# EAGLE design rx (EAGLE 9.1.3)
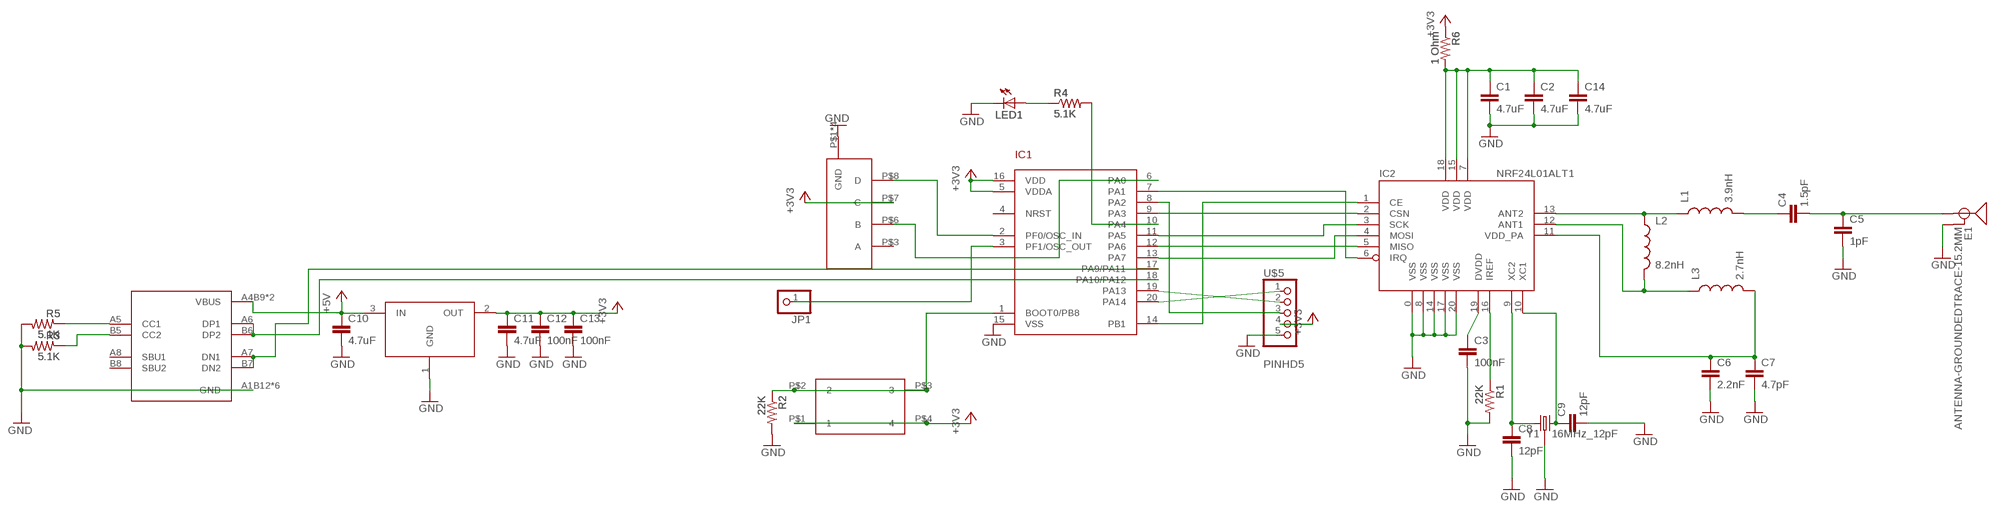
[diagram p0: schematic, sheet 1]

## Parts
C1  4.7uF  CAP0805  [0805]
C2  4.7uF  CAP0805  [0805]
C3  100nF  CAP0805  [0805]
C4  1.5pF  CAP0805  [0805]
C5  1pF  CAP0805  [0805]
C6  2.2nF  CAP0805  [0805]
C7  4.7pF  CAP0805  [0805]
C8  12pF  CAP0805  [0805]
C9  12pF  CAP0805  [0805]
C10  4.7uF  CAP0805  [0805]
C11  4.7uF  CAP0805  [0805]
C12  100nF  CAP0805  [0805]
C13  100nF  CAP0805  [0805]
C14  4.7uF  CAP0805  [0805]
E1  ANTENNA-GROUNDEDTRACE-15.2MM  [TRACE_ANTENNA_2.4GHZ_15.2MM]
IC1  STM32F042F4  [TSSOP20]
IC2  NRF24L01ALT1  [QFN20_ALT1]
JP1  PINHD-1X1CB  [1X01-CLEANBIG]
L1  3.9nH  INDUCTOR0805  [0805]
L2  8.2nH  INDUCTOR0805  [0805]
L3  2.7nH  INDUCTOR0805  [0805]
LED1  LEDCHIP-LED0805  [CHIP-LED0805]
R1  22K  RESISTOR0805-RES  [0805]
R2  22K  RESISTOR0805-RES  [0805]
R3  5.1K  RESISTOR0805-RES  [0805]
R4  5.1K  RESISTOR0805-RES  [0805]
R5  5.1K  RESISTOR0805-RES  [0805]
R6  1 Ohm  RESISTOR0805-RES  [0805]
SW1  SW_3POS_DEVSW_3POS_OFFICIAL  [SW_3POS_FOOT_OFFICIAL]
SW2  324_SW324_SWITCH_FOOT_HOLE  [342_SWICH_FOOT_HOLE]
U1  USBC_16P  [USBC_16P_FOOT]
U2  XC6206_DEV  [SOT23R_INFINEON]
U$5  PINHD5  [1X05]
Y1  16MHz_12pF  CRYSTAL-26MHZSMD-3.2X2.5  [CRYSTAL-SMD-3.2X2.5MM]

## Nets
+3V3: C11.1 C12.1 C13.1 IC1.5(VDDA) IC1.16(VDD) R6.1 SW1.P$7(C) SW2.P$1 SW2.P$4 U2.2(OUT) U$5.4
+5V: C10.1 U1.A4B9(VBUS) U1.B4A9(VBUS) U2.3(IN)
GND: C1.2 C2.2 C3.2 C5.2 C6.2 C7.2 C8.2 C9.2 C10.2 C11.2 C12.2 C13.2 C14.2 E1.GND IC1.15(VSS) IC2.0(VSS) IC2.8(VSS) IC2.14(VSS) IC2.17(VSS) IC2.20(VSS) LED1.C R1.2 R2.2 R3.2 R5.2 SW1.P$1(GND) SW1.P$2(GND) SW1.P$4(GND) SW1.P$5(GND) U1.A1B12(GND) U1.B11A12(GND) U1.P$13(GND) U1.P$14(GND) U1.P$15(GND) U1.P$16(GND) U2.1(GND) U$5.5 Y1.2 Y1.4
N$1: C3.1 IC2.19(DVDD)
N$2: IC2.16(IREF) R1.1
N$3: IC2.13(ANT2) L1.1 L2.1
N$4: C4.1 L1.2
N$5: C4.2 C5.1 E1.ANT(SIGNAL)
N$6: IC2.12(ANT1) L2.2 L3.1
N$7: C8.1 IC2.9(XC2) Y1.1
N$8: C6.1 C7.1 IC2.11(VDD_PA) L3.2
N$9: C9.1 IC2.10(XC1) Y1.3
N$10: IC1.2(PF0/OSC_IN) SW1.P$8(D)
N$11: IC1.1(BOOT0/PB8) R2.1 SW2.P$2 SW2.P$3
N$12: IC1.17(PA9/PA11) U1.A7(DN1) U1.B7(DN2)
N$13: IC1.18(PA10/PA12) U1.A6(DP1) U1.B6(DP2)
N$14: IC1.12(PA6) IC2.5(MISO)
N$15: IC1.13(PA7) IC2.4(MOSI)
N$16: IC1.11(PA5) IC2.3(SCK)
N$17: IC1.19(PA13) U$5.2
N$18: LED1.A R4.1
N$19: IC1.3(PF1/OSC_OUT) JP1.1
N$20: IC1.20(PA14) U$5.1
N$21: IC1.8(PA2) U$5.3
N$22: IC1.14(PB1) IC2.1(CE)
N$23: IC1.10(PA4) R4.2
N$24: IC1.9(PA3) IC2.2(CSN)
N$25: R3.1 U1.B5(CC2)
N$26: IC1.6(PA0) SW1.P$6(B)
N$27: R5.1 U1.A5(CC1)
N$28: C1.1 C2.1 C14.1 IC2.7(VDD) IC2.15(VDD) IC2.18(VDD) R6.2
N$30: IC1.7(PA1) IC2.6(IRQ)
Unconnected: IC1.4(NRST) SW1.P$3(A) U1.A8(SBU1) U1.B8(SBU2)

## Library data of the parts
C1-C14 = clock:CAP: Capacitor Standard 0603 ceramic capacitor, and 0.1" leaded capacitor.
E1 = SparkFun-RF:ANTENNA-GROUNDED: Antenna w/ Ground Connection 2.4GHz antennae with signal and ground terminals. TRACE_ANTENNA_2.4GHZ_15.2MM - Meander Trace antenna 15.2 x 5.7mm footprint Based on layout from TI app note AN043 <http://www.ti.com/lit/an/swra117d/swra117d.pdf>. TRACE_ANTENNA_2.4GHZ_25.7MM - Inverted F trace antenna 25.7 x 7.5 mm footprint. Based on layout from TI design note DN0007 <http://www.ti.com/lit/an/swru120b/swru120b.pdf>.
IC1 = tx:STM32F042F4
IC2 = nRF24L01-Chip-v13:NRF24L01: 2.4GHz Low Power Transceiver This is the very popular, low cost, very low power RF transceiver from Nordic Semiconductor. Simple SPI interface. SKU: COM-00690
JP1 = adafruit_changed:PINHD-1X1: Pin header 1x1 for 0.1" spacing With round pins
L1-L3 = basicBoard:INDUCTOR: Inductors Basic Inductor/Choke - 0603 and 1206. Footprints are not proven and vary greatly between part numbers. INDUCTOR POWER 3.3UH 4.0A SMD 0.197" L x 0.197" W x 0.177" H (5.00mm x 5.00mm x 4.50mm)
LED1 = joyAnalog:LED: LED OSRAM: - CHIPLED LG R971, LG N971, LY N971, LG Q971, LY Q971, LO R971, LY R971 LH N974, LH R974 LS Q976, LO Q976, LY Q976 LO Q996 - Hyper CHIPLED LW Q18S LB Q993, LB Q99A, LB R99A - SideLED LS A670, LO A670, LY A670, LG A670, LP A670 LB A673, LV A673, LT A673, LW A673 LH A674 LY A675 LS A676, LA A676, LO A676, LY A676, LW A676 LS A679, LY A679, LG A679 - Hyper Micro SIDELED® LS Y876, LA Y876, LO Y876, LY Y876 LT Y87S - SmartLED LW L88C, LW L88S LB L89C, LB L89S, LG L890 LS L89K, LO L89K, LY L89K LS L896, LA L896, LO L896, LY L896 - TOPLED LS T670, LO T670, LY T670, LG T670, LP T670 LSG T670, LSP T670, LSY T670, LOP T670, LYG T670 LG T671, LOG T671, LSG T671 LB T673, LV T673, LT T673, LW T673 LH T674 LS T676, LA T676, LO T676, LY T676, LB T676, LH T676, LSB T676, LW T676 LB T67C, LV T67C, LT T67C, LS T67K, LO T67K, LY T67K, LW E67C LS E67B, LA E67B, LO E67B, LY E67B, LB E67C, LV E67C, LT E67C LW T67C LS T679, LY T679, LG T679 LS T770, LO T770, LY T770, LG T770, LP T770 LB T773, LV T773, LT T773, LW T773 LH T774 LS E675, LA E675, LY E675, LS T675 LS T776, LA T776, LO T776, LY T776, LB T776 LHGB T686 LT T68C, LB T68C - Hyper Mini TOPLED® LB M676 - Mini TOPLED Santana® LG M470 LS M47K, LO M47K, LY M47K Source: http://www.osram.convergy.de/
R1-R6 = joyAnalog:RESISTOR: Resistor Basic schematic elements and footprints for 0603, 1206, and PTH resistors.
SW1 = 3pos_slide_switch_centered:SW_3POS_DEV
SW2 = 3pos_slide_switch:324_SW
U1 = my_usbc_16p:USBC_16P
U2 = 3pos_slide_switch:XC6206_DEV
U$5 = adafruit_changed:PINHD5
Y1 = SparkFun-Clocks:CRYSTAL-26MHZ: 26MHz Crystal w/ Ground Pin Digikey Example <http://www.digikey.com/product-detail/en/epson/TSX-3225%2026.0000MF09Z-AC3/SER3627CT-ND/1802878> Frequency: 26MHz Frequency Stability: ±9ppm Frequency Tolerance: ±10ppm Load Capacitance: 9pF SparkFun Products: SparkFun ESP32 Thing <https://www.sparkfun.com/products/13907> SparkFun ESP8266 Thing Dev Board <https://www.sparkfun.com/products/13711>; PROD_ID: XTAL-12454

## Board
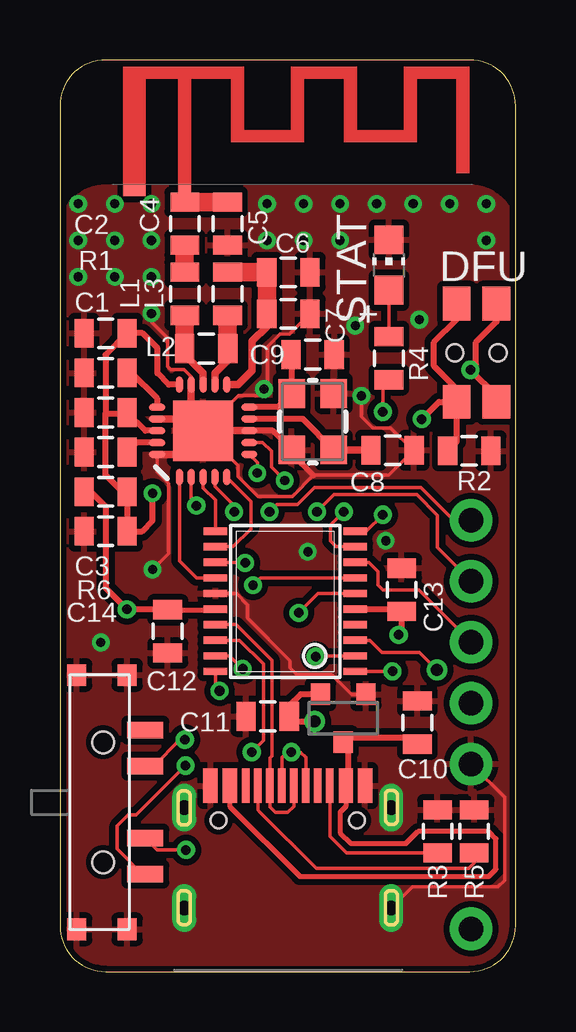
[diagram p1: board, top side]
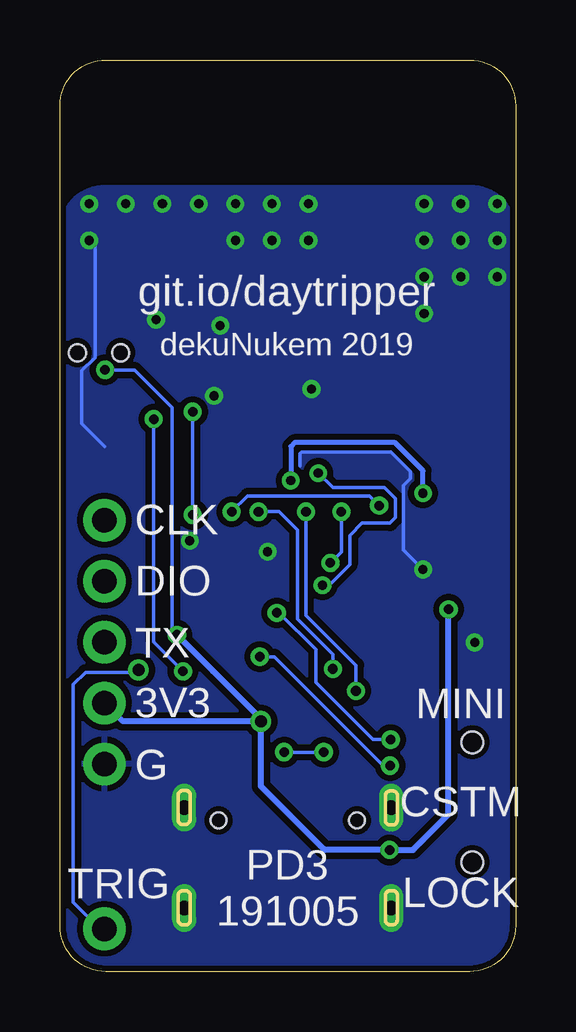
[diagram p2: board, bottom side, seen from below]

Size 19 x 38 mm. Coordinates in mm from the lower left corner, seen from the top.
Outline: 0,36.09 0,1.91 arc90 1.91,0 17.09,0 arc90 19,1.91 19,36.09 arc90 17.09,38 1.91,38 arc90 0,36.09
Copper layers (1*16): Top 0.035mm / dielectric 1.5mm / Bottom 0.035mm
Design rules "SparkFun-2-layer-TIGHT *": minimum track width 6mil, minimum drill 15mil, track to track 6mil, track to pad 6mil, pad to pad 6mil, via to via 6mil, smd to smd 6mil, copper to edge 8mil, drill to drill 6mil, minimum pad ring 7mil, minimum via ring 7mil, stop-mask expansion 4mil, vias tented up to drill 25mil, thermal gap 10mil

### Footprints (pad centres in the part's own frame; a part is rotated, then mirrored left to right if it is on the bottom)
0805 = smd 0.8 x 1.2: 1 -0.9,0; 2 0.9,0
TRACE_ANTENNA_2.4GHZ_15.2MM = smd 0.5 x 0.5: ANT 0,-0.25 | smd 0.9 x 0.5: GND -2.1,-0.25
TSSOP20 = smd 0.305 x 0.991: 1 -2.925,-2.918; 2 -2.275,-2.918; 3 -1.625,-2.918; 4 -0.975,-2.918; 5 -0.325,-2.918; 6 0.325,-2.918; 7 0.975,-2.918; 8 1.625,-2.918; 9 2.275,-2.918; 10 2.925,-2.918; 11 2.925,2.918; 12 2.275,2.918; 13 1.625,2.918; 14 0.975,2.918; 15 0.325,2.918; 16 -0.325,2.918; 17 -0.975,2.918; 18 -1.625,2.918; 19 -2.275,2.918; 20 -2.925,2.918
QFN20_ALT1 = smd 2.515 x 2.515: 0 0,0 | smd 0.686 x 0.293: 1 -1.925,0.986; 2 -1.925,0.493; 3 -1.925,0; 4 -1.925,-0.493; 5 -1.925,-0.986; 11 1.925,-0.986; 12 1.925,-0.493; 13 1.925,0; 14 1.925,0.493; 15 1.925,0.986 | smd 0.293 x 0.686: 6 -0.986,-1.925; 7 -0.493,-1.925; 8 0,-1.925; 9 0.493,-1.925; 10 0.986,-1.925; 16 0.986,1.925; 17 0.493,1.925; 18 0,1.925; 19 -0.493,1.925; 20 -0.986,1.925
1X01-CLEANBIG = drill 1.016 pad 1.778: 1 0,0
CHIP-LED0805 = smd 1.2 x 1.2: A 0,-1.05; C 0,1.05
SW_3POS_FOOT_OFFICIAL = smd 0.9 x 0.8: P$1 -5.3,-1.05; P$2 -5.3,1.05; P$4 5.3,1.05; P$5 5.3,-1.05 | smd 0.7 x 1.5: P$3 -3,1.8; P$6 -1.5,1.8; P$7 1.5,1.8; P$8 3,1.8 | hole 0.9: -2.5,0.05; 2.5,0.05
342_SWICH_FOOT_HOLE = smd 1.4 x 1.15: P$1 -2.05,-0.825; P$2 -2.05,0.825; P$3 2.05,0.825; P$4 2.05,-0.825 | hole 0.7: 0,0.9; 0,-0.9
USBC_16P_FOOT = smd 0.6 x 1.45: A1B12 -3.225,3.848; A4B9 -2.425,3.848; B4A9 2.425,3.848; B11A12 3.225,3.848 | smd 0.3 x 1.45: A5 -1.25,3.848; A6 -0.25,3.848; A7 0.25,3.848; A8 1.25,3.848; B5 1.75,3.848; B6 0.75,3.848; B7 -0.75,3.848; B8 -1.75,3.848 | drill 0.6 pad 1 long: P$13 -4.32,2.933; P$14 4.32,2.933; P$15 -4.32,-1.248; P$16 4.32,-1.248 | hole 0.65: -2.89,2.402; 2.89,2.402
SOT23R_INFINEON = smd 0.8 x 0.9: 1 -0.95,-1; 2 0.95,-1; 3 0,1
1X05 = drill 1.016 pad 1.778: 1 -6.35,0; 2 -3.81,0; 3 -1.27,0; 4 1.27,0; 5 3.81,0
CRYSTAL-SMD-3.2X2.5MM = smd 1.2 x 1.1: 1 -1.175,-0.875; 2 1.175,-0.875; 3 1.175,0.875; 4 -1.175,0.875

### Placement (x,y rotation side)
C1  1.91,23.3 180 top
C2  1.91,26.61 180 top
C3  1.91,21.65 180 top
C4  5.21,31.18 90 top
C5  6.99,31.18 270 top
C6  9.53,29.15 0 top
C7  9.53,27.42 0 top
C8  13.87,21.73 0 top
C9  10.54,25.72 0 top
C10  14.91,10.38 90 top
C11  8.66,10.63 180 top
C12  4.5,14.18 270 top
C13  14.25,15.92 90 top
C14  1.91,18.35 180 top
E1  5.21,32.82 0 top
IC1  9.4,15.43 90 top
IC2  5.97,22.54 90 top
JP1  17.14,1.78 0 top
L1  5.21,28.26 90 top
L2  6.1,25.97 0 top
L3  6.99,28.26 90 top
LED1  13.72,29.45 0 top
R1  1.91,24.96 180 top
R2  17.07,21.7 0 top
R3  15.75,5.84 90 top
R4  13.72,25.57 270 top
R5  17.27,5.84 90 top
R6  1.91,20 0 top
SW1  1.75,7.06 270 top
SW2  17.37,25.79 90 top
U1  9.5,3.9 0 top
U2  11.81,10.56 180 top
U$5  17.14,12.46 270 top
Y1  10.54,22.92 90 top

### Tracks (layer width: path | path; a pad name or v marks a point on that pad's centre or on a via)
+3V3  (via drill 0.4, 0.5)
  Top 0.152: SW1.P$7 4.05,5.07 v5.26,5.07
  Top 0.203: 4.48,15.1 C12.1 6.45,15.08 IC1.16
  Top 0.254: IC1.5 14.16,15.11 C13.1 14.25,14.16 v14.12,14.03 | U2.2 10.03,11.56 9.56,11.09 C11.1 9.77,10.43 v10.62,10.43 | 18.2,24.21 SW2.P$1 18.2,24 v17.12,25.08 17.35,25.31 17.35,26.24 18.2,27.09 SW2.P$4 | R6.1 1.28,20 1.91,19.38 1.91,15.99 v2.79,15.1 4.48,15.1
  Bottom 0.152: v17.12,25.08 15.89,25.08 14.33,23.52 14.33,14.24 v14.12,14.03
  Bottom 0.254: v10.62,10.43 10.62,7.72 7.96,5.07 v5.26,5.07 4.28,5.07 2.79,6.55 v2.79,15.1 | v10.62,10.43 16.38,10.43 U$5.4 | v14.12,14.03 12.62,12.53 10.62,10.53 v10.62,10.43
+5V
  Top 0.203: U1.B4A9 11.93,6.88 11.68,6.64 11.68,5.79 12.14,5.33 14.43,5.33 14.94,5.84 17.88,5.84 18.19,5.54 18.19,4.27 17.88,3.96 10.01,3.96 7.08,6.89 U1.A4B9
  Top 0.254: C10.1 14.63,9.75 12.01,9.75 U2.3 12,9.37 12,7.82 U1.B4A9
GND  (via drill 0.38)
  Top 0.152: 9.67,21.59 Y1.4 | U2.1 12.17,11.56 11.33,12.39 9.86,12.39 9.6,12.65 9.6,12.95 7.82,14.73 7.82,15.29 7.36,15.76 IC1.15 | 5.97,22.3 6.22,22.3 7.43,21.09 7.43,20.64 8.26,19.81 9.69,19.81 10.57,20.69 13.73,20.69 C8.2 14.72,21.73 13.79,22.66 13.06,22.66 12.57,23.14 v12.57,24 | U$5.5 18.54,7.25 18.54,3.81 18.26,3.53 14.7,3.53 U1.P$16 | IC2.14 5.48,24.8 5.18,25.09 4.62,25.09 4.5,25.22 4.5,26.42 3.81,27.1 v3.81,27.43 | 6.78,22.54 6.81,22.57 6.81,23.37 7.44,24 8.23,24 v8.51,24.28 8.66,24.43 8.66,26.06 9.17,26.57 9.58,26.57 C7.2 | IC2.20 4.04,20.83 4.53,20.34 4.53,17.44 v3.86,16.76
  Top 0.254: Y1.4 8.87,22.54 IC2.8 | 10.57,20.69 9.67,21.59
  Top 0.305: IC2.8 6.78,22.54 IC2.0 | IC2.0 5.48,22.54 5.48,23.04 | 5.48,23.04 IC2.14 | IC2.17 5.48,23.04 | IC2.20 5.97,21.56 5.97,22.3 IC2.0
  Bottom 0.152: v3.86,16.76 4.67,17.58 4.67,20.27 4.39,20.55 4.39,20.85 5.21,21.67 8.91,21.67 8.99,21.59 8.99,21.08 | v17.78,30.48 17.53,30.23 17.53,25.6 18.09,25.04 18.09,22.84 17.14,21.89
  other vias: 0.76,32 2.29,32 0.76,30.48 2.29,30.48 0.76,28.96 3.81,32 3.81,30.48 2.29,28.96 3.81,28.96 8.64,32 8.64,30.48 10.16,32 10.16,30.48 11.68,32 13.21,32 14.73,32 14.99,27.18 16.26,32 17.78,32 11.68,30.48 1.7,13.72 13.59,17.96 12.32,26.92 10.34,17.5
  pour Top (isolate 0.254): 1.91,0 17.09,0 arc90 19,1.91 19,30.84 arc90 17.09,32.75 1.91,32.75 arc90 0,30.84 0,1.91 arc90
  pour Bottom (isolate 0.254): 0,30.84 0,1.91 arc90 1.91,0 17.09,0 arc90 19,1.91 19,30.84 arc90 17.09,32.75 1.91,32.75 arc90
N$1
  Top 0.254: IC2.19 3.2,22.05 C3.1
N$2
  Top 0.254: R1.1 2.98,24.96 4.04,23.9 IC2.16
N$3
  Top 0.305: IC2.13 5.97,24.96 5.2,25.73 L2.1 5.21,25.98
  Top 0.762: 5.21,25.98 L1.1
N$4
  Top 0.762: L1.2 C4.1
N$5
  Top 0.254: C4.2 E1.ANT
  Top 0.762: C5.1 C4.2
N$6
  Top 0.305: IC2.12 6.46,24.94 7,25.48 L2.2 6.99,25.98
  Top 0.762: 6.99,25.98 L3.1
N$7
  Top 0.254: IC2.9 10.13,23.04 Y1.1 11.45,21.78
  Top 0.305: C8.1 11.5,21.73 11.45,21.78
N$8
  Top 0.305: C6.1 | IC2.11 7.42,24.47 8.02,25.06 8.02,26.28 8.62,26.89 C7.1
  Top 0.762: C6.1 L3.2 | C6.1 8.62,28.19 C7.1
N$9
  Top 0.254: IC2.10 9.1,23.53 Y1.3 9.67,25.69 C9.1
N$10  (via drill 0.4)
  Top 0.152: v10.67,13.12 10.7,13.16 IC1.2 | SW1.P$8 3.43,4.06 2.39,5.11 2.39,6.07 2.85,6.53 3.17,6.53 v5.23,8.59
  Bottom 0.152: v10.67,13.12 10.06,13.12 5.52,8.59 v5.23,8.59
N$11  (via drill 0.4)
  Top 0.152: IC1.1 v13.86,12.51 v13.87,12.51
  Top 0.254: SW2.P$3 16.55,27.18 15.6,26.23 15.6,25.23 16.4,24.43 16.4,23.9 SW2.P$2 | v15.09,23.03 15.8,23.74 SW2.P$2 | R2.1 16.55,22.09 SW2.P$2
  Bottom 0.152: v13.87,12.51 15.09,13.73 v15.09,23.03
N$12
  Top 0.152: IC1.17 7.35,14.46 8.84,12.97 8.84,8.99 8.75,8.9 U1.B7 8.75,6.87 8.99,6.63 9.5,6.63 9.75,6.88 U1.A7
N$13  (via drill 0.4)
  Top 0.152: IC1.18 7.49,13.81 8.48,12.82 8.48,9.63 v8,9.14 | U1.A6 9.25,8.92 9.47,9.14 v9.65,9.14 10.03,9.14 10.25,8.93 U1.B6
  Bottom 0.152: v8,9.14 v9.65,9.14
N$14
  Top 0.152: IC2.5 7.98,19.6 7.98,18.46 7.23,17.71 IC1.12
N$15  (via drill 0.4)
  Top 0.152: IC1.13 7.7,17.06 v7.72,17.03 | IC2.4 6.46,20.22 7.26,19.42 v7.26,19.17
  Bottom 0.152: v7.26,19.17 7.26,17.49 v7.72,17.03
N$16
  Top 0.152: IC2.3 5.97,20.16 6.48,19.65 IC1.11
N$17  (via drill 0.4)
  Top 0.152: IC1.19 7.08,13.16 v7.62,12.61 | v10.72,19.17 11.43,19.88 14.88,19.88 15.75,19.02 15.75,17.67 U$5.2
  Bottom 0.152: v7.62,12.61 7.62,13.22 9.09,14.7 9.09,18.41 9.86,19.17 v10.72,19.17
N$18
  Top 0.152: LED1.A R4.1
N$19  (via drill 0.5)
  Top 0.152: IC1.3 12.94,13.81 13.31,13.44 13.44,13.31 14.99,13.31 v15.72,12.57
  Bottom 0.152: JP1.1 17.32,1.78 18.44,2.9 18.44,11.96 17.93,12.47 15.82,12.47 v15.72,12.57
N$20  (via drill 0.4)
  Top 0.152: IC1.20 6.48,11.88 v6.66,11.7 | v8.74,19.17 9.04,19.47 9.91,19.47 10.62,20.18 15.06,20.18 16.43,18.81 U$5.1
  Bottom 0.152: v6.66,11.7 6.66,12.77 8.74,14.85 v8.74,19.17
N$21
  Top 0.152: IC1.8 12.88,17.06 13.26,16.68 13.26,16.12 13.46,15.92 14.96,15.92 U$5.3
N$22
  Top 0.152: IC1.14 5.69,16.41 4.98,17.11 IC2.1
N$23  (via drill 0.4)
  Top 0.152: v13.46,23.33 13.46,24.41 R4.2 | IC1.10 12.78,18.36 v13.46,19.04
  Bottom 0.152: v13.46,19.04 v13.46,23.33
N$24  (via drill 0.4)
  Top 0.152: v11.84,19.17 11.28,18.61 11.28,17.95 11.52,17.71 IC1.9 | IC2.2 5.48,19.64 v5.69,19.42
  Bottom 0.152: v5.69,19.42 6.1,19.83 11.18,19.83 v11.84,19.17
N$25
  Top 0.152: R3.1 11.95,4.94 11.25,5.64 U1.B5
N$26  (via drill 0.4)
  Top 0.152: v9.96,14.95 10.76,15.76 IC1.6 | v5.21,9.67 5.02,9.67 3.91,8.56 SW1.P$6
  Bottom 0.152: v9.96,14.95 9.86,14.95 8.33,13.43 8.33,12.06 5.94,9.67 v5.21,9.67
N$27
  Top 0.152: R5.1 17.27,4.52 17.04,4.29 10.69,4.29 8.32,6.66 8.33,6.66 8.25,6.74 U1.A5
N$28  (via drill 0.38)
  Top 0.152: IC2.7 8.46,22.05 8.81,21.69 8.81,21.03 v9.37,20.47
  Top 0.254: IC2.18 3.57,22.54 C1.1 2.77,23.27 1.91,23.27 | IC2.15 4.54,24.47 4.06,24.94 4.06,25.98 3.44,26.61 C2.1 1.91,25.71 1.91,23.27 | 1.91,23.27 1.91,20.7 2.6,20 R6.2 C14.1 3.42,18.35 3.86,18.8 v3.86,19.94
  Bottom 0.203: v3.86,19.94 3.86,20.88 5.03,22.05 9.22,22.05 9.37,21.89 v9.37,20.47
N$30  (via drill 0.38)
  Top 0.152: IC2.6 8.23,21.22 v8.23,20.78 | v8.05,16.1 8.36,16.41 IC1.7
  Bottom 0.152: v8.23,20.78 7.62,20.17 5.46,20.17 5,19.71 5,18.92 5.23,18.69 6.4,18.69 6.91,18.19 6.91,16.97 7.77,16.1 v8.05,16.1

### Text on the board
tNames: STAT | DFU
bNames: git.io/daytripper | dekuNukem 2019 | CLK | DIO | TX | MINI | 3V3 | G | CSTM | PD3 / 191005 | LOCK | TRIG